# Altium project 4.4 - SCT2430 TEST.PrjPcb
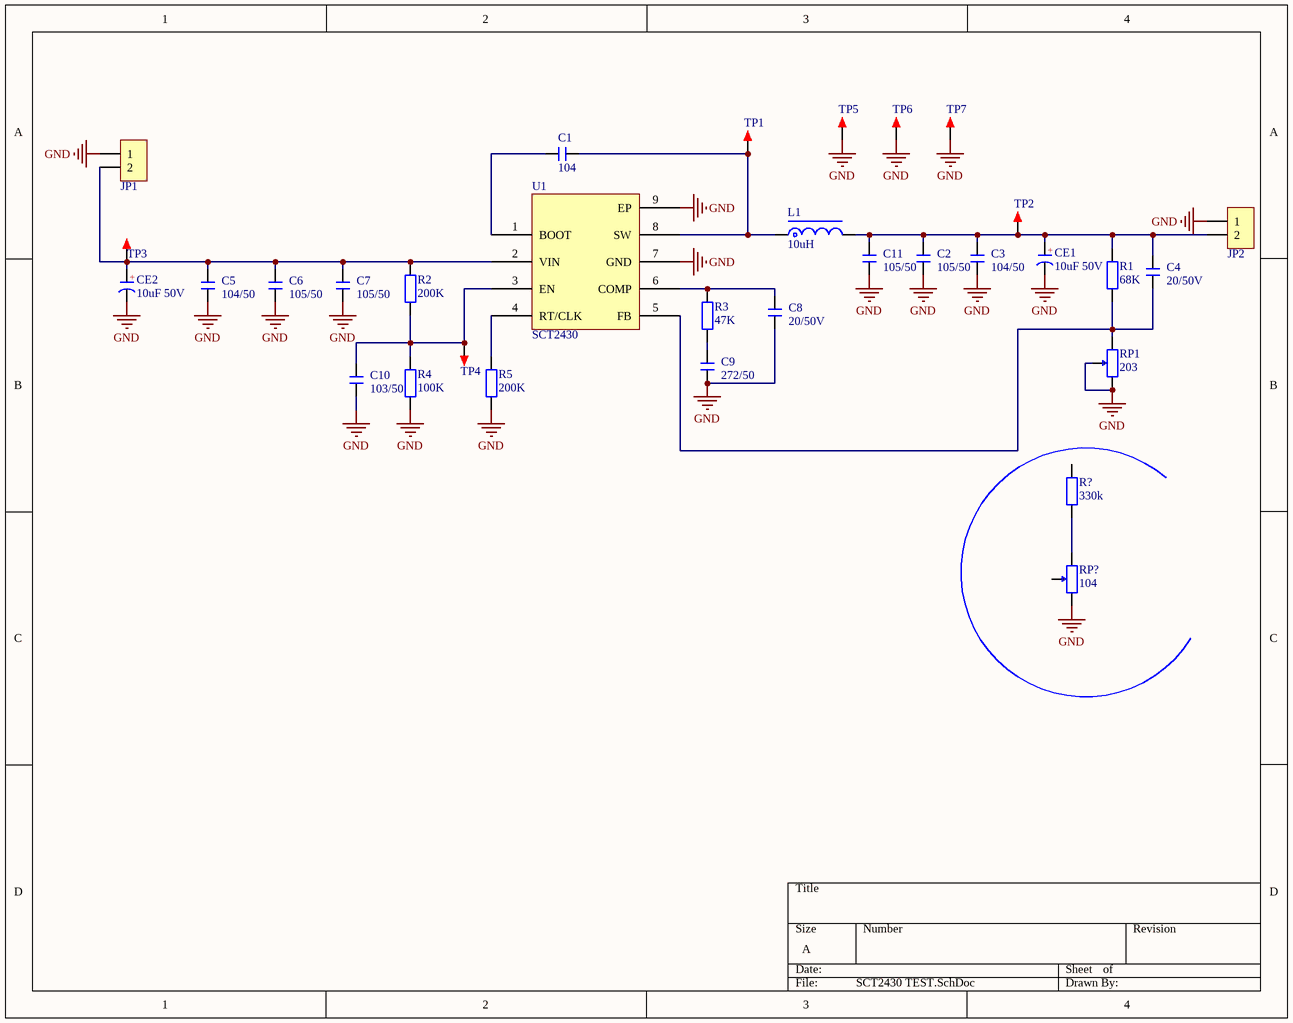
[diagram p0: SCT2430 TEST.SchDoc]
1 sheet, 32 parts. Net scope: global (net labels, ports and power ports of the same name join across sheets).
Board file: SCT2430 TEST.PcbDoc

## Sheet SCT2430 TEST.SchDoc
size A

### Parts
C1  104  [C 0805_L]
C2  105/50  [C 0805_L]
C3  104/50  [C 0805_L]
C4  20/50V  [C 0805_L]
C5  104/50  [C 0805_L]
C6  105/50  [C 0805_L]
C7  105/50  [C 0805_L]
C8  20/50V  [C 0805_L]
C9  272/50  [C 0805_L]
C10  103/50  [C 0805_L]
C11  105/50  [C 0805_L]
CE1  10uF 50V  [CM C(5*5.4)]
CE2  10uF 50V  [CM C(5*5.4)]
JP1  HDR-1X2  [KF2EDGK5.08-LI-2P]  (value not drawn)
JP2  HDR-1X2  [KF2EDGK5.08-LI-2P]  (value not drawn)
L1  10uH  [CDRH127]
R1  68K  [R 0805_L]
R2  200K  [R 0805_L]
R3  47K  [R 0805_L]
R4  100K  [R 0805_L]
R5  200K  [R 0805_L]
R?  330k  [R 0805_L]
RP1  203  [3296W]
RP?  104  [3296W]
TP1  SW  [TEST TP1.4_Y]  (value not drawn)
TP2  TEST TP  [TEST TP1.4_R]  (value not drawn)
TP3  TEST TP  [TEST TP1.4_R]  (value not drawn)
TP4  TEST TP  [TEST TP1.4_G]  (value not drawn)
TP5  SW  [TEST TP1.4_Y]  (value not drawn)
TP6  SW  [TEST TP1.4_Y]  (value not drawn)
TP7  SW  [TEST TP1.4_Y]  (value not drawn)
U1  SCT2430  [ESOP - 8]

### Nets
GND: C2.1 C3.1 C5.1 C6.1 C7.1 C8.1 C9.1 C10.1 C11.1 CE1.2(K) CE2.2(K) JP1.1 JP2.1 R4.1 R5.1 RP1.1 RP1.2 RP?.1 TP5.1 TP6.1 TP7.1 U1.7(GND) U1.9(EP)
NetC1_1: C1.1 U1.1(BOOT)
NetC1_2: C1.2 L1.1 TP1.1 U1.8(SW)
NetC2_2: C2.2 C3.2 C4.2 C11.2 CE1.1(A) JP2.2 L1.2 R1.2 TP2.1
NetC4_1: C4.1 R1.1 RP1.3 U1.5(FB)
NetC5_2: C5.2 C6.2 C7.2 CE2.1(A) JP1.2 R2.2 TP3.1 U1.2(VIN)
NetC8_2: C8.2 R3.2 U1.6(COMP)
NetC9_2: C9.2 R3.1
NetC10_2: C10.2 R2.1 R4.2 TP4.1 U1.3(EN)
NetR5_2: R5.2 U1.4(RT/CLK)
NetR?_1: R?.1 RP?.3

Not connected (* = marked no-connect by the designer): R? 2; RP? 2

### Notes on the sheet
- (in symbol CE_SMD) +

### Library data of the parts
C1-C11 = C: 贴片电容; 淘宝ID: 小糖豆的小窝窝; BOM名称: 贴片电容; 下单链接: https://item.taobao.com/item.htm?ft=t&id=613637044352
CE1 CE2 = CE_SMD: 贴片电解电容; 淘宝ID: 小糖豆的小窝窝; BOM名称: 贴片电解电容; 下单链接: https://item.taobao.com/item.htm?ft=t&id=613637044352
JP1 JP2 = Header 2: 2P接插件; 淘宝ID: 小糖豆的小窝窝; BOM名称: 2P接插件; 下单链接: https://item.taobao.com/item.htm?ft=t&id=613637044352
L1 = L-CDRH: 功率屏蔽电感; 淘宝ID: 小糖豆的小窝窝; BOM名称: 功率屏蔽电感; 下单链接: https://item.taobao.com/item.htm?ft=t&id=613637044352
R1-R5 R? = R: 贴片电阻; 淘宝ID: 小糖豆的小窝窝; BOM名称: 贴片电阻; 下单链接: https://item.taobao.com/item.htm?ft=t&id=613637044352
RP1 RP? = RP: 单联电位器; 淘宝ID: 小糖豆的小窝窝; BOM名称: 单联电位器; 下单链接: https://item.taobao.com/item.htm?ft=t&id=613637044352
TP1-TP7 = TEST TP: 测试环; 淘宝ID: 小糖豆的小窝窝; BOM名称: 测试环; 下单链接: https://item.taobao.com/item.htm?ft=t&id=613637044352
U1 = TPS54340